# Altium schematic sheet STM32_microcontroller_power.SchDoc: STM32 microcontroller power part
size A4; Date: Not used; ApprovedBy: Not used; CheckedBy: Not used; Author: Not used; CompanyName: STMicroelectronics; DrawnBy: Not used; Engineer: Not used; Organization: Not used; Address1: Not used; Address2: Not used; Address3: Not used; Address4: Not used; DocumentNumber: 4; Revision: Not used; SheetNumber: 4; SheetTotal: 8; CurrentTime: Not used; CurrentDate: Not used; Time: Not used; DocumentFullPathAndName: Not used; DocumentName: Not used; ModifiedDate: Not used; ImagePath: Not used; ProjectName: Not used; Application_BuildNumber: Not used
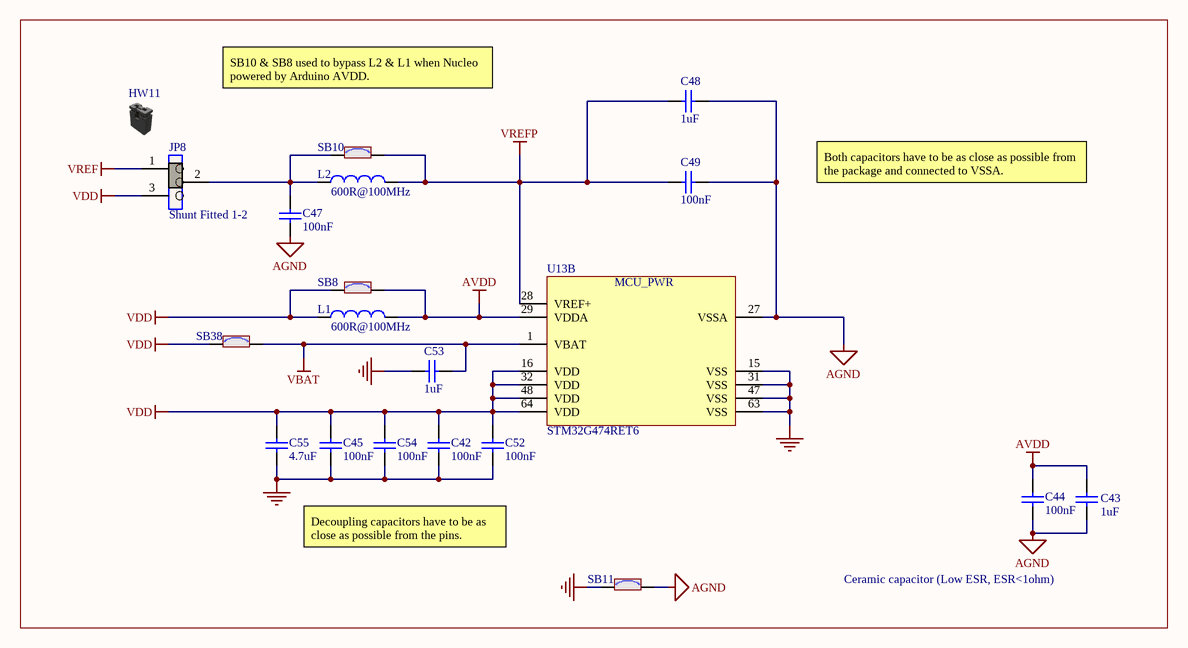
[diagram p0: STM32_microcontroller_power.SchDoc]

## Parts
C42  value 100nF  [C0402]
C43  value 1uF  [C0603]
C44  value 100nF  [C0402]
C45  value 100nF  [C0402]
C47  value 100nF  [C0402]
C48  value 1uF  [C0603]
C49  value 100nF  [C0402]
C52  value 100nF  [C0402]
C53  value 1uF  [C0603]
C54  value 100nF  [C0402]
C55  value 4.7uF  [C0603]
HW11  (no value)  (mechanical)
JP8  Shunt Fitted 1-2  [CON_SAMTEC_TSW-103-07-F-S]
L1  value 600R@100MHz  [L0603]
L2  value 600R@100MHz  [L0603]
SB8  (no value)  [SOLDER-BRIDGE_R0603-0R]
SB10  (no value)  [SOLDER-BRIDGE_R0603-0R]
SB11  (no value)  [SOLDER-BRIDGE_R0603-0R]
SB38  (no value)  [SOLDER-BRIDGE_R0603-0R]
U13  value STM32G474RET6  [ICC_LQFP64_10X10_P050_SOCKET_YAMAICHI_IC149-064-069-B5_NM]  (hidden comment: STM32G4xx_LQFP64)  (part B of 2)

## Blocks framed on the sheet
Ceramic capacitor (Low ESR, ESR<1ohm): C42-C45 C47-C49 C52-C55 HW11 JP8 L1 L2 SB8 SB10 SB11 SB38 U13

## Nets
AGND: C43.1 C44.1 C47.1 C48.2 C49.2 SB11.2 U13.27(VSSA)
AVDD: C43.2 C44.2 L1.2 SB8.2 U13.29(VDDA)
GND: C42.1 C45.1 C52.1 C53.1 C54.1 C55.1 SB11.1 U13.15(VSS) U13.31(VSS) U13.47(VSS) U13.63(VSS)
VBAT: C53.2 SB38.2 U13.1(VBAT)
VDD: C42.2 C45.2 C52.2 C54.2 C55.2 JP8.3 L1.1 SB8.1 SB38.1 U13.16(VDD) U13.32(VDD) U13.48(VDD) U13.64(VDD)
VREF: JP8.1
VREFP: C48.1 C49.1 L2.2 SB10.2 U13.28(VREF+)
NetC47_2: C47.2 JP8.2 L2.1 SB10.1

## Notes on the sheet
- SB10 & SB8 used to bypass L2 & L1 when Nucleo powered by Arduino AVDD.
- Both capacitors have to be as close as possible from the package and connected to VSSA.
- Decoupling capacitors have to be as close as possible from the pins.
- Title:
- Project:
- Size:
- Revision:
- Variant:
- A4
- -
- Date:
- Reference:
- Sheet:
- of
- (in symbol MCD-01243, part B) MCU_PWR

## Library data of the parts
C42 C44 C45 C47 C49 C52 C54 = MCD-00102: Capacitor, MLCC, 100nF, 16V, X7R, 10%, 0402, T=0,5mm; Manufacturer_Part_Number: CC0402KRX7R7BB104; Manufacturer: YAGEO; Provided_By: Subcon; Initial_Board_Reference: MB1262; Internal_Part_Number: MCD-00102; Status: Released; Package: C0402; ComponentLink1Description: Yageo_Capacitor_X7R-series.pdf; ECCN_US: n/a; ECCN_EU: n/a; Part_Type: Capacitor; ComponentLink1URL: http://tunmcdsvn.tun.st.com/Component_Datasheet_Library/Trunk/Capacitors/Yageo_Multilayer_Capacitor_X7R_series_100pF_to_22uF
C43 C48 C53 = MCD-00010: Capacitor, MLCC, 1uF, 16V, X5R, 10%, 0603, T=0,8mm; Manufacturer_Part_Number: CC0603KRX5R7BB105; Manufacturer: YAGEO; Provided_By: Subcon; Initial_Board_Reference: MB1274; Internal_Part_Number: MCD-00010; Status: Released; Package: C0603; ComponentLink1Description: Yageo_Capacitor_X5R-series.pdf; ECCN_US: n/a; ECCN_EU: n/a; Part_Type: Capacitor; ComponentLink1URL: http://tunmcdsvn.tun.st.com/Component_Datasheet_Library/Trunk/Capacitors/Yageo_Multilayer_capacitor_X5R_series_100pF_to_100uF
C55 = MCD-00009: Capacitor, MLCC, 4.7uF, 16V, X5R, 10%, 0603, T=0.8mm; Manufacturer_Part_Number: CC0603KRX5R7BB475; Manufacturer: YAGEO; Provided_By: subcon; Initial_Board_Reference: MB1274; Internal_Part_Number: MCD-00009; ComponentLink1Description: Yageo_Capacitor_X5R-series.pdf; ECCN_US: n/a; ECCN_EU: n/a; Status: Released; Part_Type: Capacitor; Package: C0603; ComponentLink1URL: http://tunmcdsvn.tun.st.com/Component_Datasheet_Library/Trunk/Capacitors/Yageo_Multilayer_capacitor_X5R_series_100pF_to_100uF
HW11 = MCD-00043: SHUNT 2.54mm BLACK; Manufacturer_Part_Number: SNT-100-BK-G; Manufacturer: SAMTEC; Part_Type: Mechanical; Provided_By: Subcon; Initial_Board_Reference: MB1274; Internal_Part_Number: MCD-00043; ECCN_US: n/a; ECCN_EU: n/a; ComponentLink1Description: Samtec_Shunt_Jumper_SNT100.pdf; Status: Released; ComponentLink1URL: http://tunmcdsvn.tun.st.com/Component_Datasheet_Library/Trunk/Connectors/Samtec_Shunt_Jumper_SNT100
JP8 = MCD-00684: Header, 3x1, 2,54mm, VR, TH, Height 5.84mm/2.54mm - Shunt Fitted 1-2 by default; Part_Type: Connector; Manufacturer_Part_Number: TSW-103-07-F-S; Manufacturer: SAMTEC; Provided_By: Subcon; Initial_Board_Reference: MB1331; Internal_Part_Number: MCD-00684; Value: Shunt Fitted 1-2; Status: Released; ComponentLink1Description: Samtec_connector_TSW-HTSW-series.pdf; ComponentLink1URL: http://tunmcdsvn.tun.st.com/Component_Datasheet_Library/Trunk/Connectors/Samtec_TSW-HTSW-series; ECCN_US: n/a; ECCN_EU: n/a
L1 L2 = MCD-00047: SMD Chip ferrite bead, 600R@100MHz +/-25%, 350mA, 500mohm DC, 0603, T=0.8mm; Part_Type: Inductor; Manufacturer_Part_Number: FCM1608KF-601T03; Manufacturer: TAI-TECH; Provided_By: Subcon; Initial_Board_Reference: MB1274; Internal_Part_Number: MCD-00047; Status: Released; ComponentLink1Description: TaiTech_Bead_FCM1608_series.pdf; ComponentLink1URL: http://tunmcdsvn.tun.st.com/Component_Datasheet_Library/Trunk/Inductors/TaiTech_Bead_FCM1608_series; ECCN_US: n/a; ECCN_EU: n/a
SB8 SB10 SB11 SB38 = MCD-00071: Solder Bridge ON; Part_Type: Mechanical; Provided_By: Subcon; Initial_Board_Reference: MB1274; Internal_Part_Number: MCD-00071; ECCN_US: n/a; ECCN_EU: n/a; Status: Released
U13 = MCD-01243: STM32G474, LQFP64 package,  3D IC footprint with 2D socket footprint.; Manufacturer: STMICROELECTRONICS; Provided_By: SUBCO with ST control; Initial_Board_Reference: MB1367; Item Type: Item; Path: ws/MCD_ApplicationBoards/Lists/MCDPARTSdatabase; Internal_Part_Number: MCD-01243; Status: Checked; Part_Type: IC; Manufacturer_Part_Number: STM32G474RET6; Package: LQFP64; ComponentLink1Description: Datasheet; ComponentLink1URL: http://tunmcdsvn.tun.st.com/Component_Datasheet_Library/Trunk/IC/STM_MCU_STM32G4xx